# EAGLE design RPLidar_interface (EAGLE 7.4.0)

## Sheet 1 of 4
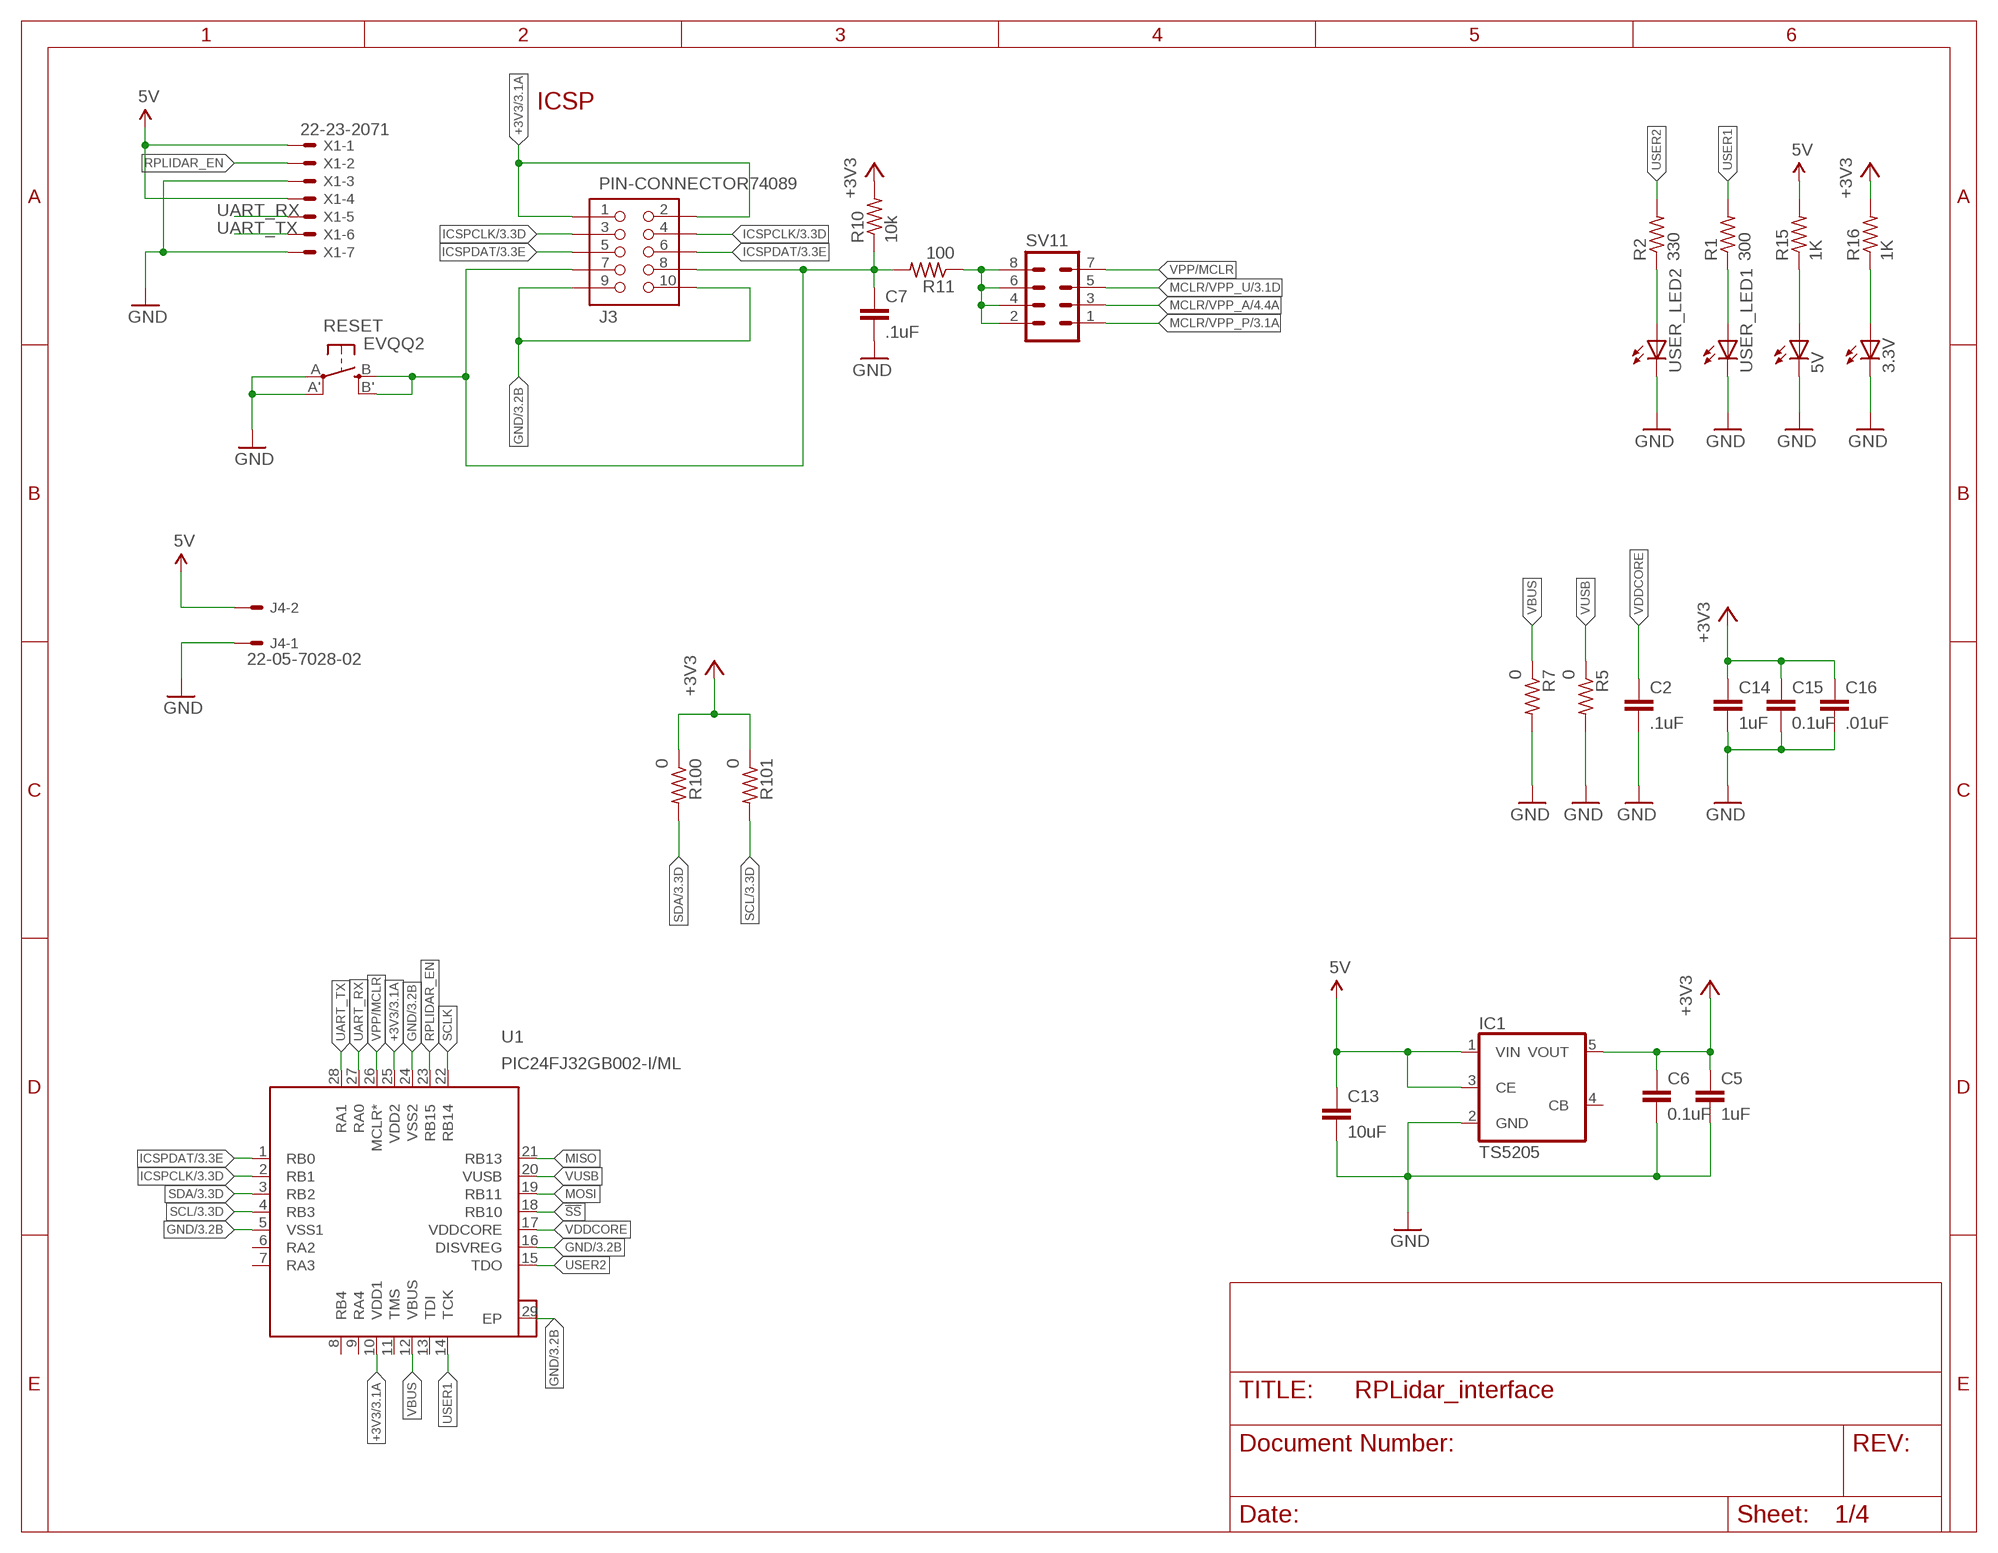
[diagram p0: schematic, sheet 1]

### Parts
3.3V  LEDCHIP-LED0603  [CHIP-LED0603]
5V  LEDCHIP-LED0603  [CHIP-LED0603]
C2  .1uF  C-EUC0402  [C0402]
C5  1uF  C-EUC0402  [C0402]
C6  0.1uF  C-EUC0402  [C0402]
C7  .1uF  C-EUC0402  [C0402]
C13  10uF  C-EUC0402  [C0402]
C14  1uF  C-EUC0402  [C0402]
C15  0.1uF  C-EUC0402  [C0402]
C16  .01uF  C-EUC0402  [C0402]
IC1  TS5205  [SOT25]
J3  PIN-CONNECTOR74089  [10-PIN-SMD]
J4  22-05-7028-02  [7395-02]
R1  300  R-US_R0402  [R0402]
R2  330  R-US_R0402  [R0402]
R5  0  R-US_R0402  [R0402]
R7  0  R-US_R0402  [R0402]
R10  10k  R-US_R0402  [R0402]
R11  100  R-US_R0402  [R0402]
R15  1K  R-US_R0402  [R0402]
R16  1K  R-US_R0402  [R0402]
R100  0  R-US_R0402  [R0402]
R101  0  R-US_R0402  [R0402]
RESET  EVQQ2  [EVQ-Q2]
SV11  MA04-2  [MA04-2]
U1  PIC24FJ32GB002-I/ML  [QFN65P600X600X100-29N]
USER_LED1  LEDCHIP-LED0603  [CHIP-LED0603]
USER_LED2  LEDCHIP-LED0603  [CHIP-LED0603]
X1  22-23-2071  [22-23-2071]

### Nets
5V: C13.1 IC1.1(VIN) IC1.3(CE) J4.2 R15.2 X1.1 X1.4 ; also sheet 4
!SS: U1.18(RB10) ; also sheet 2
+3V3: C5.1 C6.1 C14.1 C15.1 C16.1 IC1.5(VOUT) J3.1 J3.2 R10.2 R16.2 R100.1 R101.1 U1.10(VDD1) U1.25(VDD2) ; also sheet 3
GND: 3.3V.C 5V.C C2.2 C5.2 C6.2 C7.2 C13.2 C14.2 C15.2 C16.2 IC1.2(GND) J3.9 J3.10 J4.1 R5.2 R7.2 RESET.A'(P1) RESET.A(P) U1.5(VSS1) U1.16(DISVREG) U1.24(VSS2) U1.29(EP) USER_LED1.C USER_LED2.C X1.3 X1.7 ; also sheet 2,3,4
ICSPCLK: J3.3 J3.4 U1.2(RB1) ; also sheet 3,4
ICSPDAT: J3.5 J3.6 U1.1(RB0) ; also sheet 3,4
MCLR/VPP_A: SV11.3 ; also sheet 4
MCLR/VPP_P: SV11.1 ; also sheet 3
MCLR/VPP_U: SV11.5 ; also sheet 3
MCLR_LIDAR: C7.1 J3.7 J3.8 R10.1 R11.2 RESET.B'(S1) RESET.B(S)
MISO: U1.21(RB13) ; also sheet 2
MOSI: U1.19(RB11) ; also sheet 2
N$1: 3.3V.A R16.1
N$2: R1.1 USER_LED1.A
N$3: R2.1 USER_LED2.A
N$4: 5V.A R15.1
N$11: R11.1 SV11.2 SV11.4 SV11.6 SV11.8
RPLIDAR_EN: U1.23(RB15) X1.2
SCL: R101.2 U1.4(RB3) ; also sheet 2,3,4
SCLK: U1.22(RB14) ; also sheet 2
SDA: R100.2 U1.3(RB2) ; also sheet 2,3,4
UART_RX: U1.27(RA0) X1.5
UART_TX: U1.28(RA1) X1.6
USER1: R1.2 U1.14(TCK)
USER2: R2.2 U1.15(TDO)
VBUS: R7.1 U1.12(VBUS)
VDDCORE: C2.1 U1.17(VDDCORE)
VPP/MCLR: SV11.7 U1.26(MCLR*)
VUSB: R5.1 U1.20(VUSB)
Unconnected: IC1.4(CB) U1.6(RA2) U1.7(RA3) U1.8(RB4) U1.9(RA4) U1.11(TMS) U1.13(TDI)

### Notes on the sheet
- ICSP

## Sheet 2 of 4
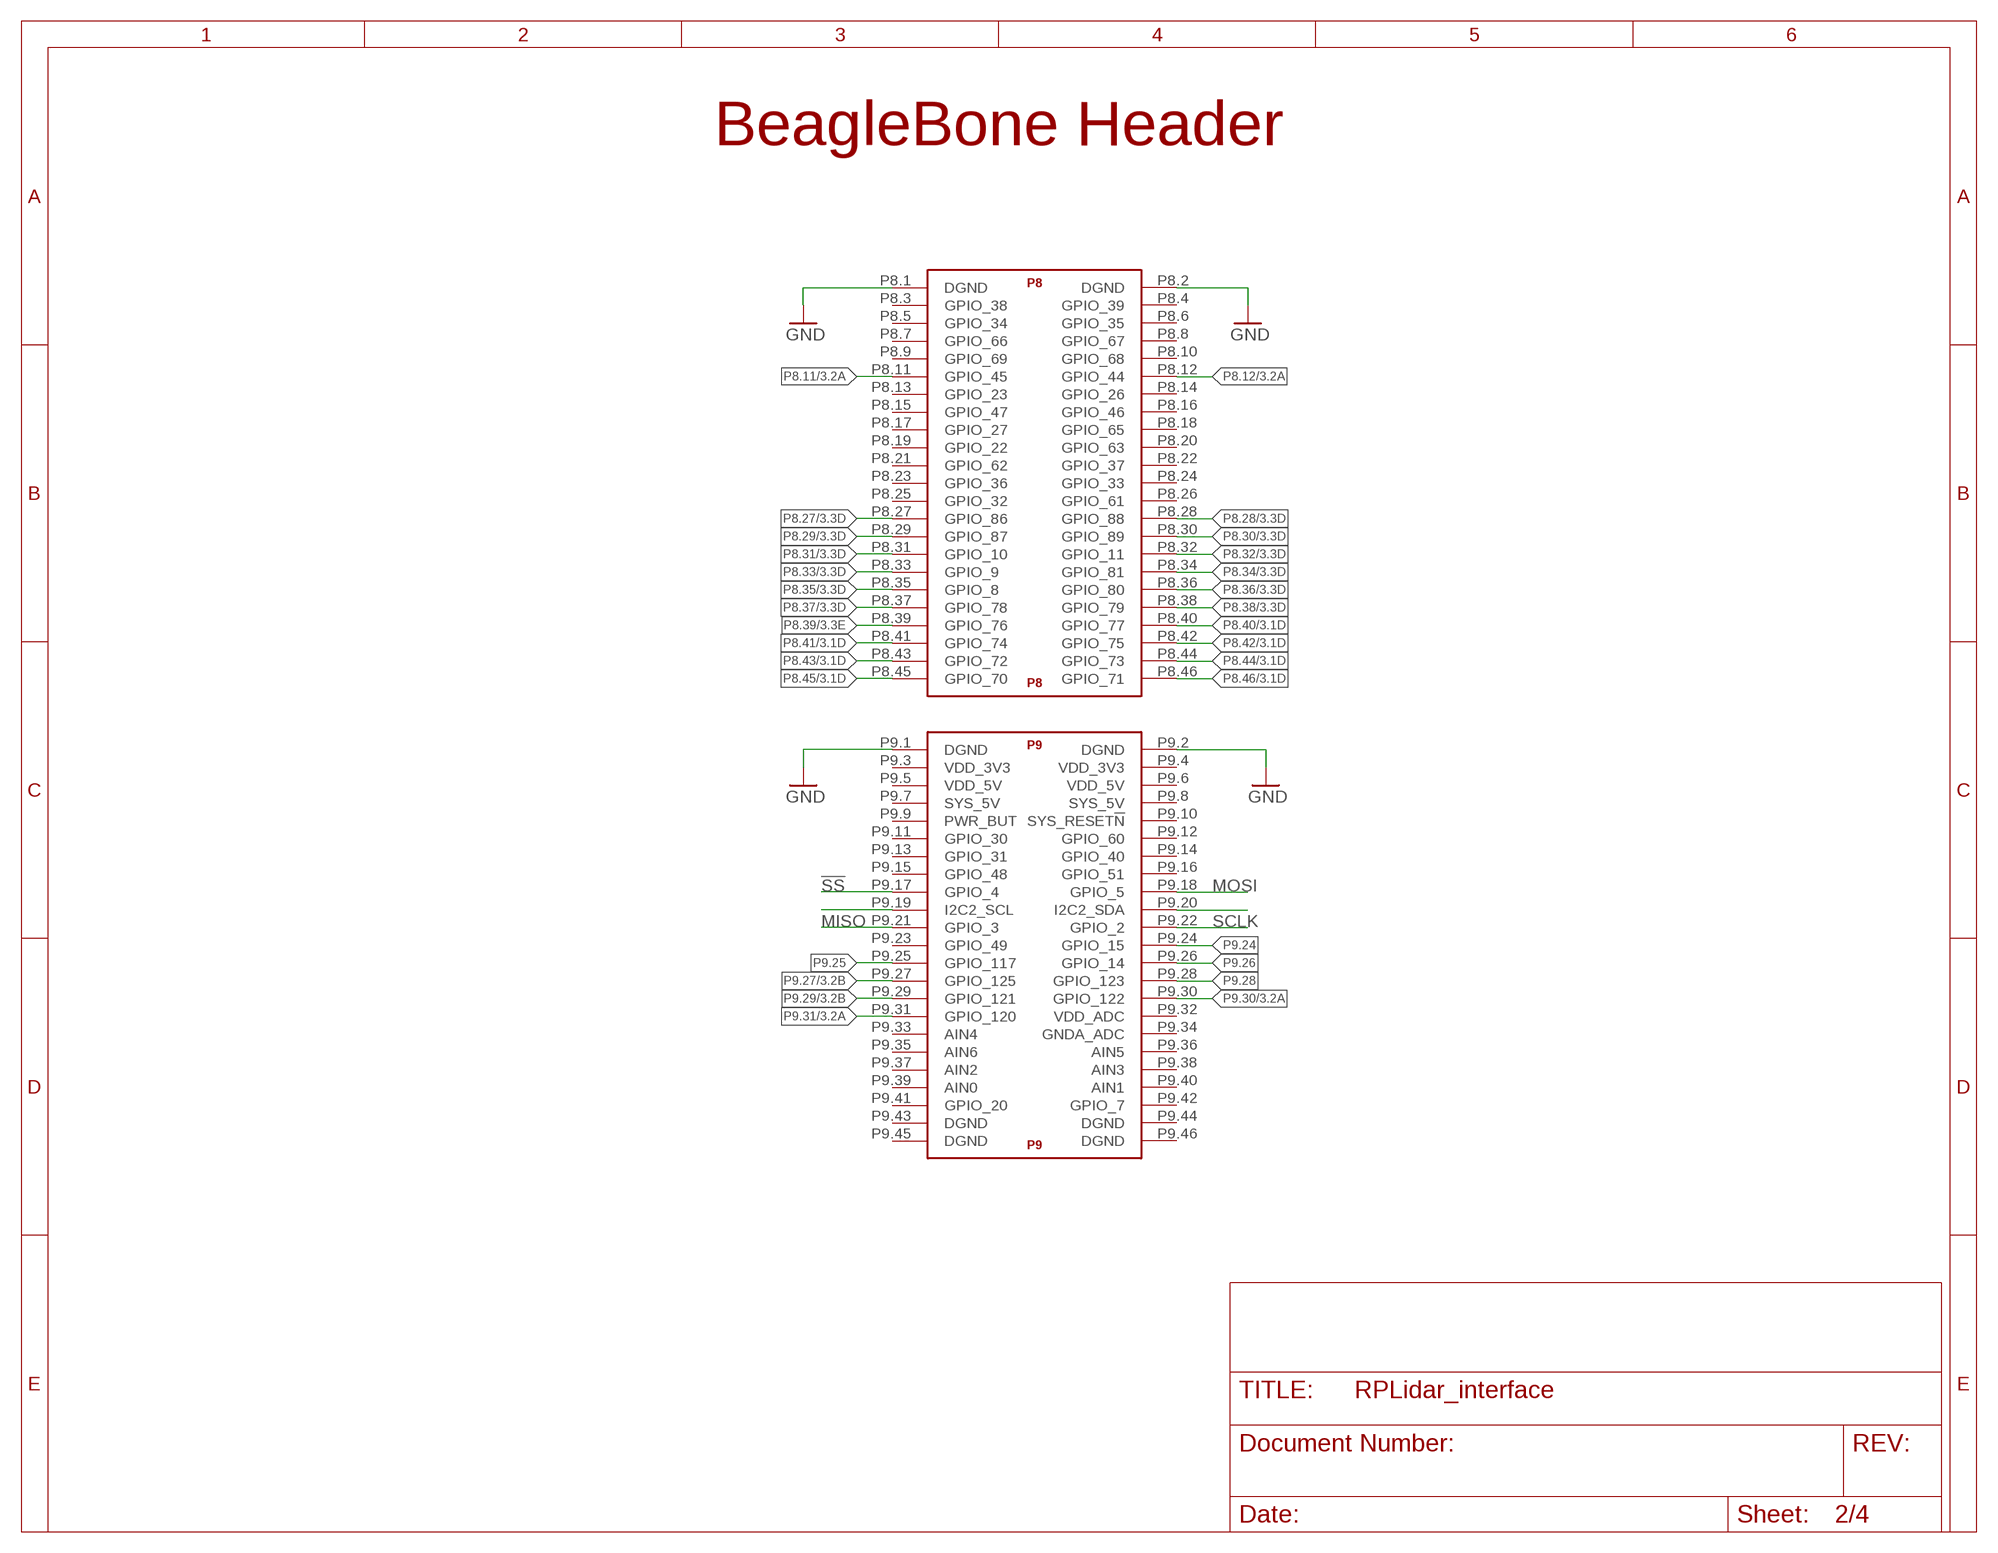
[diagram p1: schematic, sheet 2]

### Parts
U$3  BEAGLE_BONE_BLACK_CAPE  [BEAGLE_BONE_BLACK_CAPE]

### Nets
!SS: U$3.P9.17(P9:GPIO_4) ; also sheet 1
GND: U$3.P8.1(P8:DGND) U$3.P8.2(P8:DGND) U$3.P9.1(P9:DGND) U$3.P9.2(P9:DGND) ; also sheet 1,3,4
MISO: U$3.P9.21(P9:GPIO_3) ; also sheet 1
MOSI: U$3.P9.18(P9:GPIO_5) ; also sheet 1
P8.11: U$3.P8.11(P8:GPIO_45) ; also sheet 3
P8.12: U$3.P8.12(P8:GPIO_44) ; also sheet 3
P8.27: U$3.P8.27(P8:GPIO_86) ; also sheet 3
P8.28: U$3.P8.28(P8:GPIO_88) ; also sheet 3
P8.29: U$3.P8.29(P8:GPIO_87) ; also sheet 3
P8.30: U$3.P8.30(P8:GPIO_89) ; also sheet 3
P8.31: U$3.P8.31(P8:GPIO_10) ; also sheet 3
P8.32: U$3.P8.32(P8:GPIO_11) ; also sheet 3
P8.33: U$3.P8.33(P8:GPIO_9) ; also sheet 3
P8.34: U$3.P8.34(P8:GPIO_81) ; also sheet 3
P8.35: U$3.P8.35(P8:GPIO_8) ; also sheet 3
P8.36: U$3.P8.36(P8:GPIO_80) ; also sheet 3
P8.37: U$3.P8.37(P8:GPIO_78) ; also sheet 3
P8.38: U$3.P8.38(P8:GPIO_79) ; also sheet 3
P8.39: U$3.P8.39(P8:GPIO_76) ; also sheet 3
P8.40: U$3.P8.40(P8:GPIO_77) ; also sheet 3
P8.41: U$3.P8.41(P8:GPIO_74) ; also sheet 3
P8.42: U$3.P8.42(P8:GPIO_75) ; also sheet 3
P8.43: U$3.P8.43(P8:GPIO_72) ; also sheet 3
P8.44: U$3.P8.44(P8:GPIO_73) ; also sheet 3
P8.45: U$3.P8.45(P8:GPIO_70) ; also sheet 3
P8.46: U$3.P8.46(P8:GPIO_71) ; also sheet 3
P9.24: U$3.P9.24(P9:GPIO_15)
P9.25: U$3.P9.25(P9:GPIO_117) ; also sheet 3
P9.26: U$3.P9.26(P9:GPIO_14)
P9.27: U$3.P9.27(P9:GPIO_125) ; also sheet 3
P9.28: U$3.P9.28(P9:GPIO_123) ; also sheet 3
P9.29: U$3.P9.29(P9:GPIO_121) ; also sheet 3
P9.30: U$3.P9.30(P9:GPIO_122) ; also sheet 3
P9.31: U$3.P9.31(P9:GPIO_120) ; also sheet 3
SCL: U$3.P9.19(P9:I2C2_SCL) ; also sheet 1,3,4
SCLK: U$3.P9.22(P9:GPIO_2) ; also sheet 1
SDA: U$3.P9.20(P9:I2C2_SDA) ; also sheet 1,3,4
Unconnected: U$3.P8.3(P8:GPIO_38) U$3.P8.4(P8:GPIO_39) U$3.P8.5(P8:GPIO_34) U$3.P8.6(P8:GPIO_35) U$3.P8.7(P8:GPIO_66) U$3.P8.8(P8:GPIO_67) U$3.P8.9(P8:GPIO_69) U$3.P8.10(P8:GPIO_68) U$3.P8.13(P8:GPIO_23) U$3.P8.14(P8:GPIO_26) U$3.P8.15(P8:GPIO_47) U$3.P8.16(P8:GPIO_46) U$3.P8.17(P8:GPIO_27) U$3.P8.18(P8:GPIO_65) U$3.P8.19(P8:GPIO_22) U$3.P8.20(P8:GPIO_63) U$3.P8.21(P8:GPIO_62) U$3.P8.22(P8:GPIO_37) U$3.P8.23(P8:GPIO_36) U$3.P8.24(P8:GPIO_33) U$3.P8.25(P8:GPIO_32) U$3.P8.26(P8:GPIO_61) U$3.P9.3(P9:VDD_3V3) U$3.P9.4(P9:VDD_3V3) U$3.P9.5(P9:VDD_5V) U$3.P9.6(P9:VDD_5V) U$3.P9.7(P9:SYS_5V) U$3.P9.8(P9:SYS_5V) U$3.P9.9(P9:PWR_BUT) U$3.P9.10(P9:SYS_RESET!N) U$3.P9.11(P9:GPIO_30) U$3.P9.12(P9:GPIO_60) U$3.P9.13(P9:GPIO_31) U$3.P9.14(P9:GPIO_40) U$3.P9.15(P9:GPIO_48) U$3.P9.16(P9:GPIO_51) U$3.P9.23(P9:GPIO_49) U$3.P9.32(P9:VDD_ADC) U$3.P9.33(P9:AIN4) U$3.P9.34(P9:GNDA_ADC) U$3.P9.35(P9:AIN6) U$3.P9.36(P9:AIN5) U$3.P9.37(P9:AIN2) U$3.P9.38(P9:AIN3) U$3.P9.39(P9:AIN0) U$3.P9.40(P9:AIN1) U$3.P9.41(P9:GPIO_20) U$3.P9.42(P9:GPIO_7) U$3.P9.43(P9:DGND) U$3.P9.44(P9:DGND) U$3.P9.45(P9:DGND) U$3.P9.46(P9:DGND)

### Notes on the sheet
- BeagleBone Header

## Sheet 3 of 4
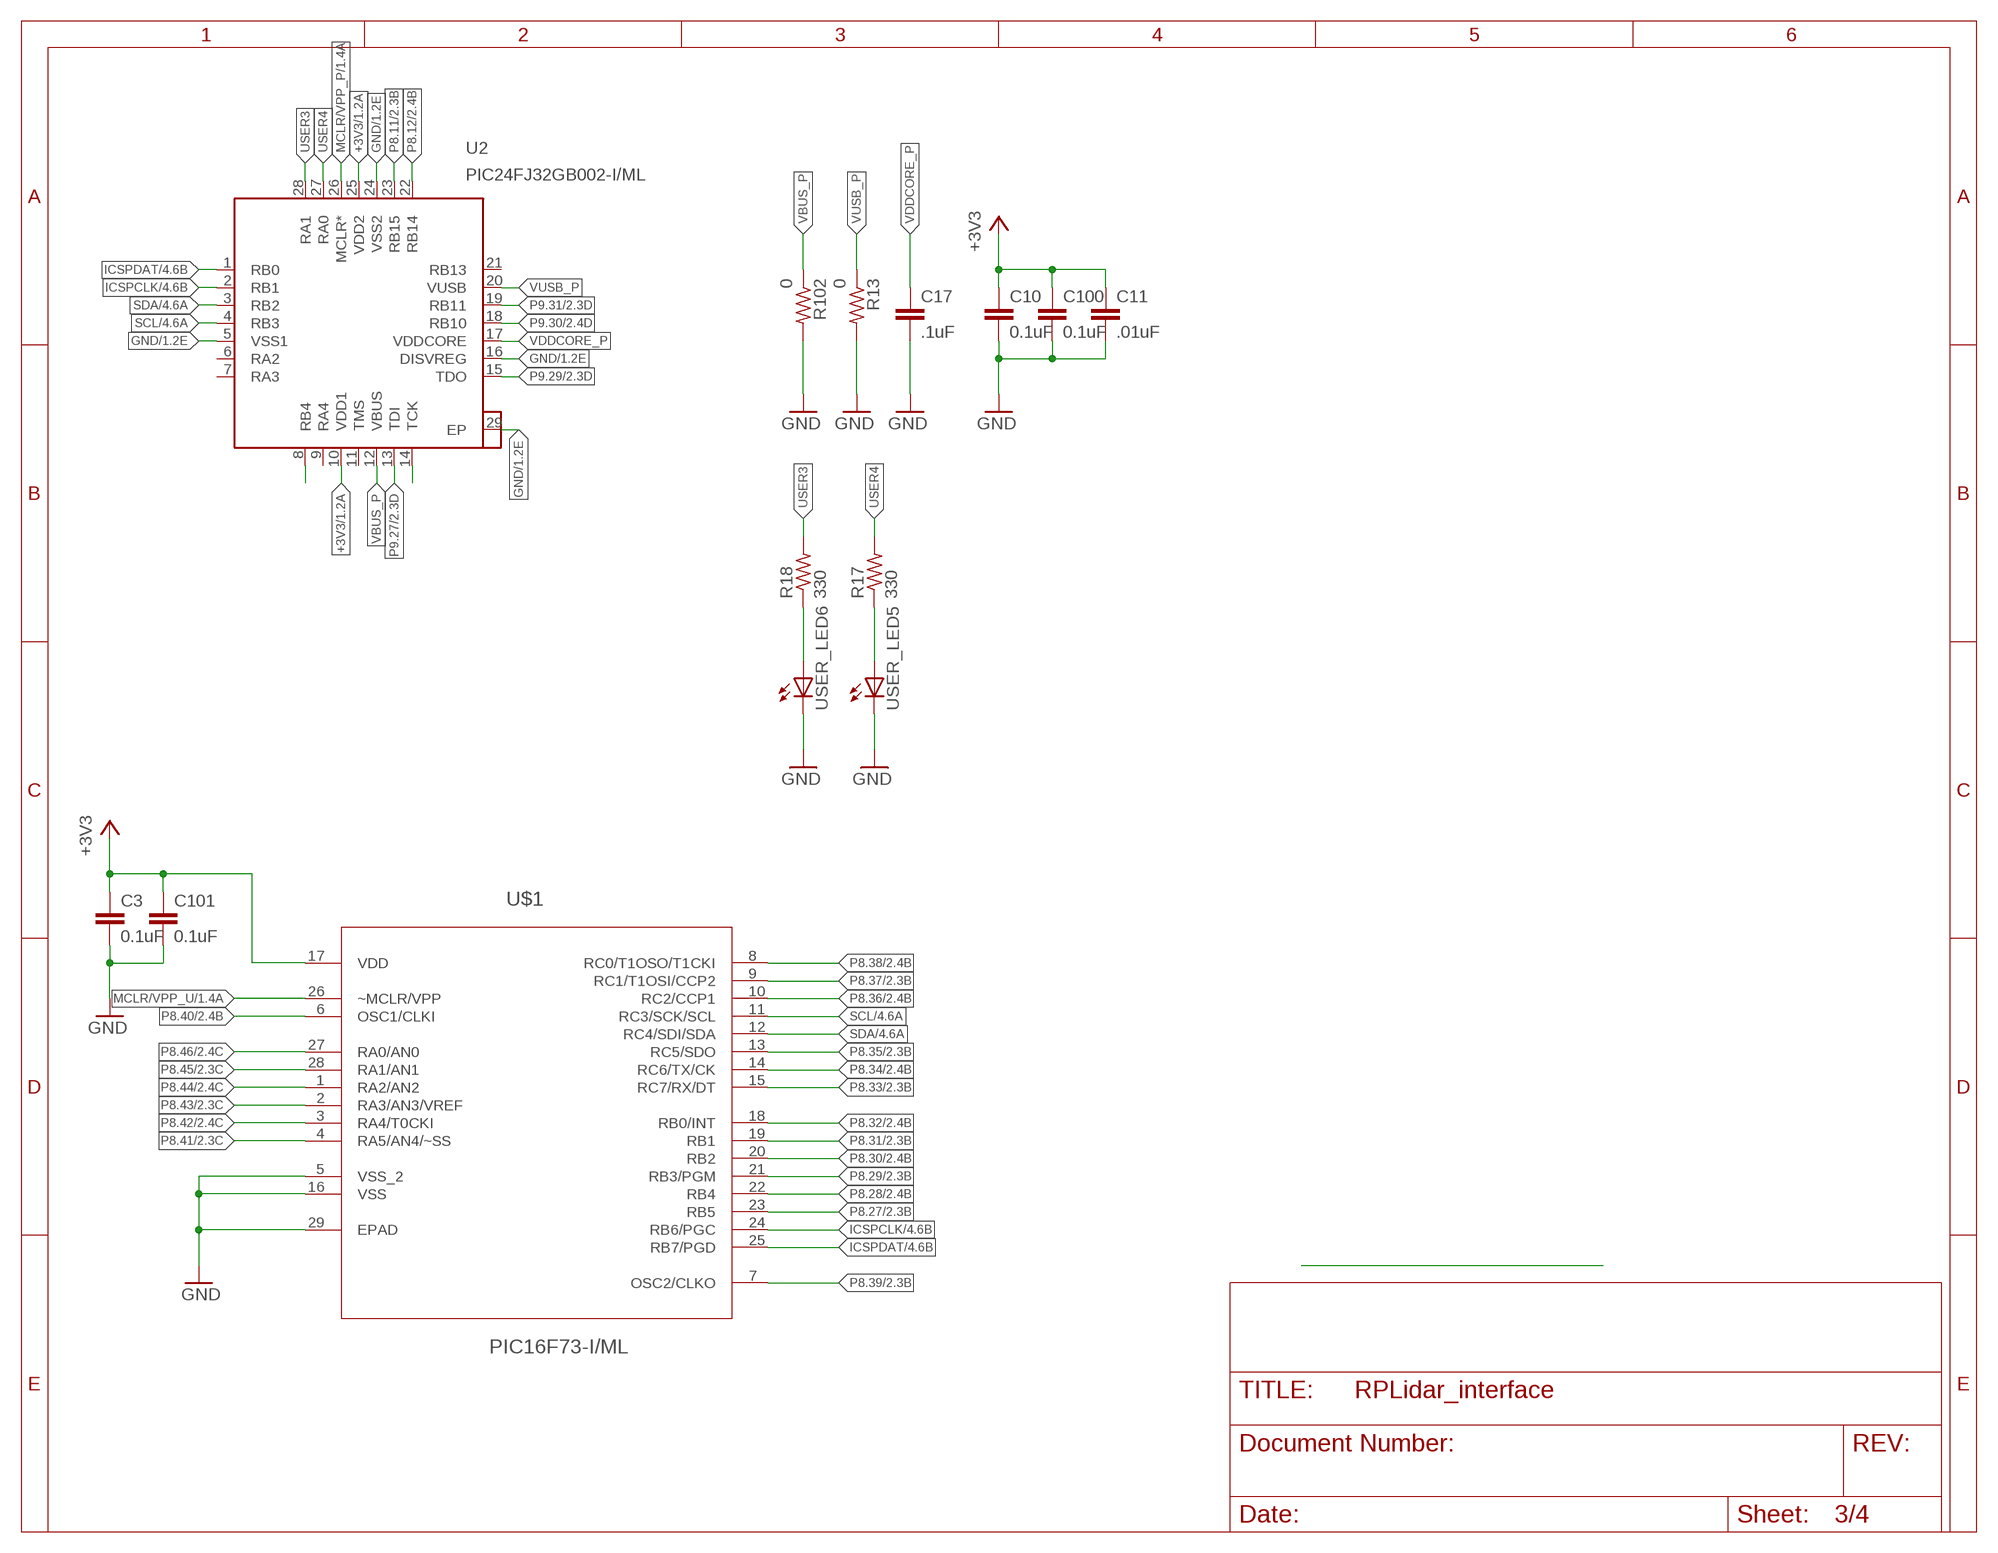
[diagram p2: schematic, sheet 3]

### Parts
C3  0.1uF  C-EUC0402  [C0402]
C10  0.1uF  C-EUC0402  [C0402]
C11  .01uF  C-EUC0402  [C0402]
C17  .1uF  C-EUC0402  [C0402]
C100  0.1uF  C-EUC0402  [C0402]
C101  0.1uF  C-EUC0402  [C0402]
R13  0  R-US_R0402  [R0402]
R17  330  R-US_R0402  [R0402]
R18  330  R-US_R0402  [R0402]
R102  0  R-US_R0402  [R0402]
U2  PIC24FJ32GB002-I/ML  [QFN65P600X600X100-29N]
U$1  PIC16F73-I/ML  [QFN65P600X600X100-28N]
USER_LED5  LEDCHIP-LED0603  [CHIP-LED0603]
USER_LED6  LEDCHIP-LED0603  [CHIP-LED0603]

### Nets
+3V3: C3.1 C10.1 C11.1 C100.1 C101.1 U2.10(VDD1) U2.25(VDD2) U$1.17(VDD) ; also sheet 1
GND: C3.2 C10.2 C11.2 C17.2 C100.2 C101.2 R13.2 R102.2 U2.5(VSS1) U2.16(DISVREG) U2.24(VSS2) U2.29(EP) U$1.5(VSS_2) U$1.16(VSS) U$1.29(EPAD) USER_LED5.C USER_LED6.C ; also sheet 1,2,4
ICSPCLK: U2.2(RB1) U$1.24(RB6/PGC) ; also sheet 1,4
ICSPDAT: U2.1(RB0) U$1.25(RB7/PGD) ; also sheet 1,4
MCLR/VPP_P: U2.26(MCLR*) ; also sheet 1
MCLR/VPP_U: U$1.26(~MCLR/VPP) ; also sheet 1
N$5: R17.1 USER_LED5.A
N$6: R18.1 USER_LED6.A
P8.11: U2.23(RB15) ; also sheet 2
P8.12: U2.22(RB14) ; also sheet 2
P8.27: U$1.23(RB5) ; also sheet 2
P8.28: U$1.22(RB4) ; also sheet 2
P8.29: U$1.21(RB3/PGM) ; also sheet 2
P8.30: U$1.20(RB2) ; also sheet 2
P8.31: U$1.19(RB1) ; also sheet 2
P8.32: U$1.18(RB0/INT) ; also sheet 2
P8.33: U$1.15(RC7/RX/DT) ; also sheet 2
P8.34: U$1.14(RC6/TX/CK) ; also sheet 2
P8.35: U$1.13(RC5/SDO) ; also sheet 2
P8.36: U$1.10(RC2/CCP1) ; also sheet 2
P8.37: U$1.9(RC1/T1OSI/CCP2) ; also sheet 2
P8.38: U$1.8(RC0/T1OSO/T1CKI) ; also sheet 2
P8.39: U$1.7(OSC2/CLKO) ; also sheet 2
P8.40: U$1.6(OSC1/CLKI) ; also sheet 2
P8.41: U$1.4(RA5/AN4/~SS) ; also sheet 2
P8.42: U$1.3(RA4/T0CKI) ; also sheet 2
P8.43: U$1.2(RA3/AN3/VREF) ; also sheet 2
P8.44: U$1.1(RA2/AN2) ; also sheet 2
P8.45: U$1.28(RA1/AN1) ; also sheet 2
P8.46: U$1.27(RA0/AN0) ; also sheet 2
P9.25: U2.8(RB4) ; also sheet 2
P9.27: U2.13(TDI) ; also sheet 2
P9.28: U2.14(TCK) ; also sheet 2
P9.29: U2.15(TDO) ; also sheet 2
P9.30: U2.18(RB10) ; also sheet 2
P9.31: U2.19(RB11) ; also sheet 2
SCL: U2.4(RB3) U$1.11(RC3/SCK/SCL) ; also sheet 1,2,4
SDA: U2.3(RB2) U$1.12(RC4/SDI/SDA) ; also sheet 1,2,4
USER3: R18.2 U2.28(RA1)
USER4: R17.2 U2.27(RA0)
VBUS_P: R102.1 U2.12(VBUS)
VDDCORE_P: C17.1 U2.17(VDDCORE)
VUSB_P: R13.1 U2.20(VUSB)
Unconnected: U2.6(RA2) U2.7(RA3) U2.9(RA4) U2.11(TMS) U2.21(RB13)

## Sheet 4 of 4
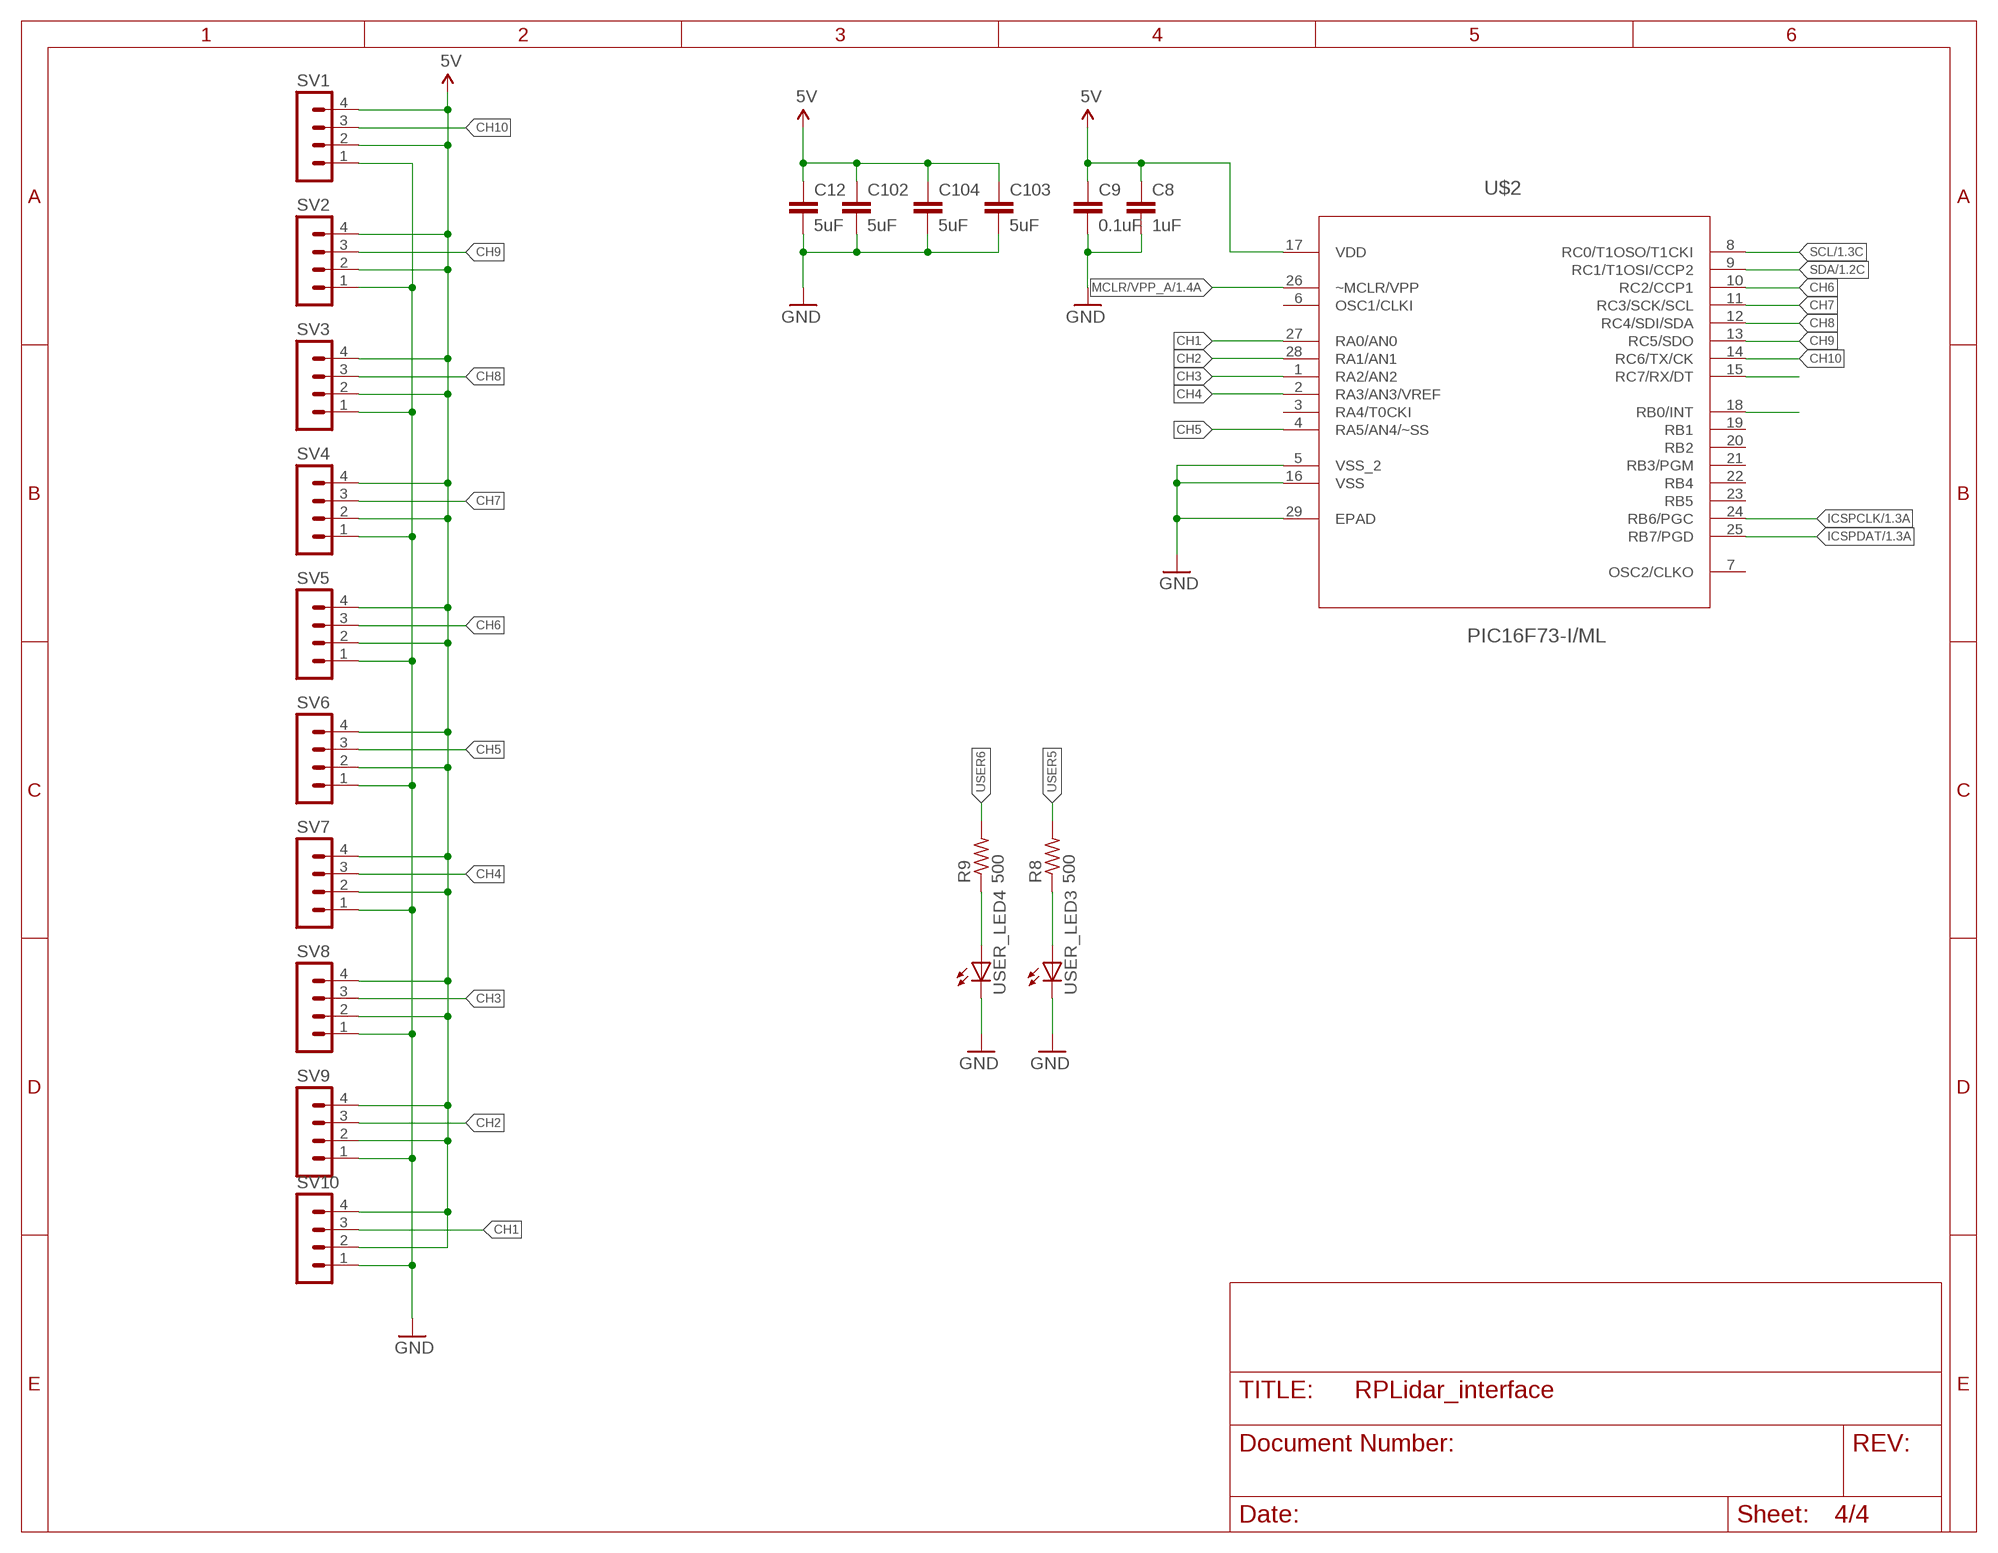
[diagram p3: schematic, sheet 4]

### Parts
C8  1uF  C-EUC0402  [C0402]
C9  0.1uF  C-EUC0402  [C0402]
C12  5uF  C-EUC0402  [C0402]
C102  5uF  C-EUC0402  [C0402]
C103  5uF  C-EUC0402  [C0402]
C104  5uF  C-EUC0402  [C0402]
R8  500  R-US_R0402  [R0402]
R9  500  R-US_R0402  [R0402]
SV1  MA04-1  [MA04-1]
SV2  MA04-1  [MA04-1]
SV3  MA04-1  [MA04-1]
SV4  MA04-1  [MA04-1]
SV5  MA04-1  [MA04-1]
SV6  MA04-1  [MA04-1]
SV7  MA04-1  [MA04-1]
SV8  MA04-1  [MA04-1]
SV9  MA04-1  [MA04-1]
SV10  MA04-1  [MA04-1]
U$2  PIC16F73-I/ML  [QFN65P600X600X100-28N]
USER_LED3  LEDCHIP-LED0603  [CHIP-LED0603]
USER_LED4  LEDCHIP-LED0603  [CHIP-LED0603]

### Nets
5V: C8.1 C9.1 C12.1 C102.1 C103.1 C104.1 SV1.2 SV1.4 SV2.2 SV2.4 SV3.2 SV3.4 SV4.2 SV4.4 SV5.2 SV5.4 SV6.2 SV6.4 SV7.2 SV7.4 SV8.2 SV8.4 SV9.2 SV9.4 SV10.2 SV10.4 U$2.17(VDD) ; also sheet 1
CH1: SV10.3 U$2.27(RA0/AN0)
CH2: SV9.3 U$2.28(RA1/AN1)
CH3: SV8.3 U$2.1(RA2/AN2)
CH4: SV7.3 U$2.2(RA3/AN3/VREF)
CH5: SV6.3 U$2.4(RA5/AN4/~SS)
CH6: SV5.3 U$2.10(RC2/CCP1)
CH7: SV4.3 U$2.11(RC3/SCK/SCL)
CH8: SV3.3 U$2.12(RC4/SDI/SDA)
CH9: SV2.3 U$2.13(RC5/SDO)
CH10: SV1.3 U$2.14(RC6/TX/CK)
GND: C8.2 C9.2 C12.2 C102.2 C103.2 C104.2 SV1.1 SV2.1 SV3.1 SV4.1 SV5.1 SV6.1 SV7.1 SV8.1 SV9.1 SV10.1 U$2.5(VSS_2) U$2.16(VSS) U$2.29(EPAD) USER_LED3.C USER_LED4.C ; also sheet 1,2,3
ICSPCLK: U$2.24(RB6/PGC) ; also sheet 1,3
ICSPDAT: U$2.25(RB7/PGD) ; also sheet 1,3
MCLR/VPP_A: U$2.26(~MCLR/VPP) ; also sheet 1
N$9: R8.1 USER_LED3.A
N$10: R9.1 USER_LED4.A
SCL: U$2.8(RC0/T1OSO/T1CKI) ; also sheet 1,2,3
SDA: U$2.9(RC1/T1OSI/CCP2) ; also sheet 1,2,3
USER5: R8.2 U$2.15(RC7/RX/DT)
USER6: R9.2 U$2.18(RB0/INT)
Unconnected: U$2.3(RA4/T0CKI) U$2.6(OSC1/CLKI) U$2.7(OSC2/CLKO) U$2.19(RB1) U$2.20(RB2) U$2.21(RB3/PGM) U$2.22(RB4) U$2.23(RB5)

## Library data of the parts
3.3V 5V USER_LED1-USER_LED6 = led:LED: LED OSRAM: - CHIPLED LG R971, LG N971, LY N971, LG Q971, LY Q971, LO R971, LY R971 LH N974, LH R974 LS Q976, LO Q976, LY Q976 LO Q996 - Hyper CHIPLED LW Q18S LB Q993, LB Q99A, LB R99A - SideLED LS A670, LO A670, LY A670, LG A670, LP A670 LB A673, LV A673, LT A673, LW A673 LH A674 LY A675 LS A676, LA A676, LO A676, LY A676, LW A676 LS A679, LY A679, LG A679 - Hyper Micro SIDELED® LS Y876, LA Y876, LO Y876, LY Y876 LT Y87S - SmartLED LW L88C, LW L88S LB L89C, LB L89S, LG L890 LS L89K, LO L89K, LY L89K LS L896, LA L896, LO L896, LY L896 - TOPLED LS T670, LO T670, LY T670, LG T670, LP T670 LSG T670, LSP T670, LSY T670, LOP T670, LYG T670 LG T671, LOG T671, LSG T671 LB T673, LV T673, LT T673, LW T673 LH T674 LS T676, LA T676, LO T676, LY T676, LB T676, LH T676, LSB T676, LW T676 LB T67C, LV T67C, LT T67C, LS T67K, LO T67K, LY T67K, LW E67C LS E67B, LA E67B, LO E67B, LY E67B, LB E67C, LV E67C, LT E67C LW T67C LS T679, LY T679, LG T679 LS T770, LO T770, LY T770, LG T770, LP T770 LB T773, LV T773, LT T773, LW T773 LH T774 LS E675, LA E675, LY E675, LS T675 LS T776, LA T776, LO T776, LY T776, LB T776 LHGB T686 LT T68C, LB T68C - Hyper Mini TOPLED® LB M676 - Mini TOPLED Santana® LG M470 LS M47K, LO M47K, LY M47K Source: http://www.osram.convergy.de LUXEON: - LUMILED® LXK2-PW12-R00, LXK2-PW12-S00, LXK2-PW14-U00, LXK2-PW14-V00 LXK2-PM12-R00, LXK2-PM12-S00, LXK2-PM14-U00 LXK2-PE12-Q00, LXK2-PE12-R00, LXK2-PE12-S00, LXK2-PE14-T00, LXK2-PE14-U00 LXK2-PB12-K00, LXK2-PB12-L00, LXK2-PB12-M00, LXK2-PB14-N00, LXK2-PB14-P00, LXK2-PB14-Q00 LXK2-PR12-L00, LXK2-PR12-M00, LXK2-PR14-Q00, LXK2-PR14-R00 LXK2-PD12-Q00, LXK2-PD12-R00, LXK2-PD12-S00 LXK2-PH12-R00, LXK2-PH12-S00 LXK2-PL12-P00, LXK2-PL12-Q00, LXK2-PL12-R00 Source: www.luxeon.com KINGBRIGHT: KA-3528ASYC Source: www.kingbright.com
C2 C3 C5-C17 C100-C104 = rcl:C-EU: CAPACITOR, European symbol
IC1 = v-reg:TS5205: 150mA Low Noise LDO Voltage Regulator with Enable TSC [Taiwan Semiconductor Company, Ltd] Source: http://www.taiwansemi.com .. 5205_0409c.pdf
J3 = Mother-Board-rev5:PIN-CONNECTOR
J4 = con-molex:22-?-02: CONNECTOR wire to board 2.54 mm (.1 inch) pitch header; OC_FARNELL: 9731601; OC_NEWARK: unknown
R1 R2 R5 R7-R11 R13 R15-R18 R100-R102 = resistor:R-US_: RESISTOR, American symbol
RESET = adafruit:EVQQ2: SMT 6mm switch, EVQQ2 series http://www.ladyada.net/library/eagle
SV1-SV10 = con-lstb:MA04-1: PIN HEADER; OC_FARNELL: unknown; OC_NEWARK: unknown
SV11 = con-lstb:MA04-2: PIN HEADER; OC_FARNELL: unknown; OC_NEWARK: unknown
U1 U2 = Microchip-PIC24:PIC24FJ32GB002-I/ML: IC MCU 16BIT 32KB FLASH,QFN-28; MPN: PIC24FJ32GB002-I/ML; OC_FARNELL: Unknown; OC_NEWARK: 07P9727; PACKAGE: QFN-28; SUPPLIER: Microchip
U$1 U$2 = Microchip_By_element14_Batch_1:PIC16F73-I/ML: 8-bit CMOS FLASH Microcontrollers; DESCRIPTION: 8-bit CMOS FLASH Microcontrollers; MPN: PIC16F73-I/ML; OC_FARNELL: 1084327; OC_NEWARK: 97K7368; PACKAGE: QFN-28; SUPPLIER: Microchip
U$3 = SparkFun-Boards:BEAGLE_BONE_BLACK_CAPE
X1 = con-molex:22-23-2071: .100" (2.54mm) Center Header - 7 Pin; MF: MOLEX; MPN: 22-23-2071; OC_FARNELL: 1654534; OC_NEWARK: 56H0445

## Board
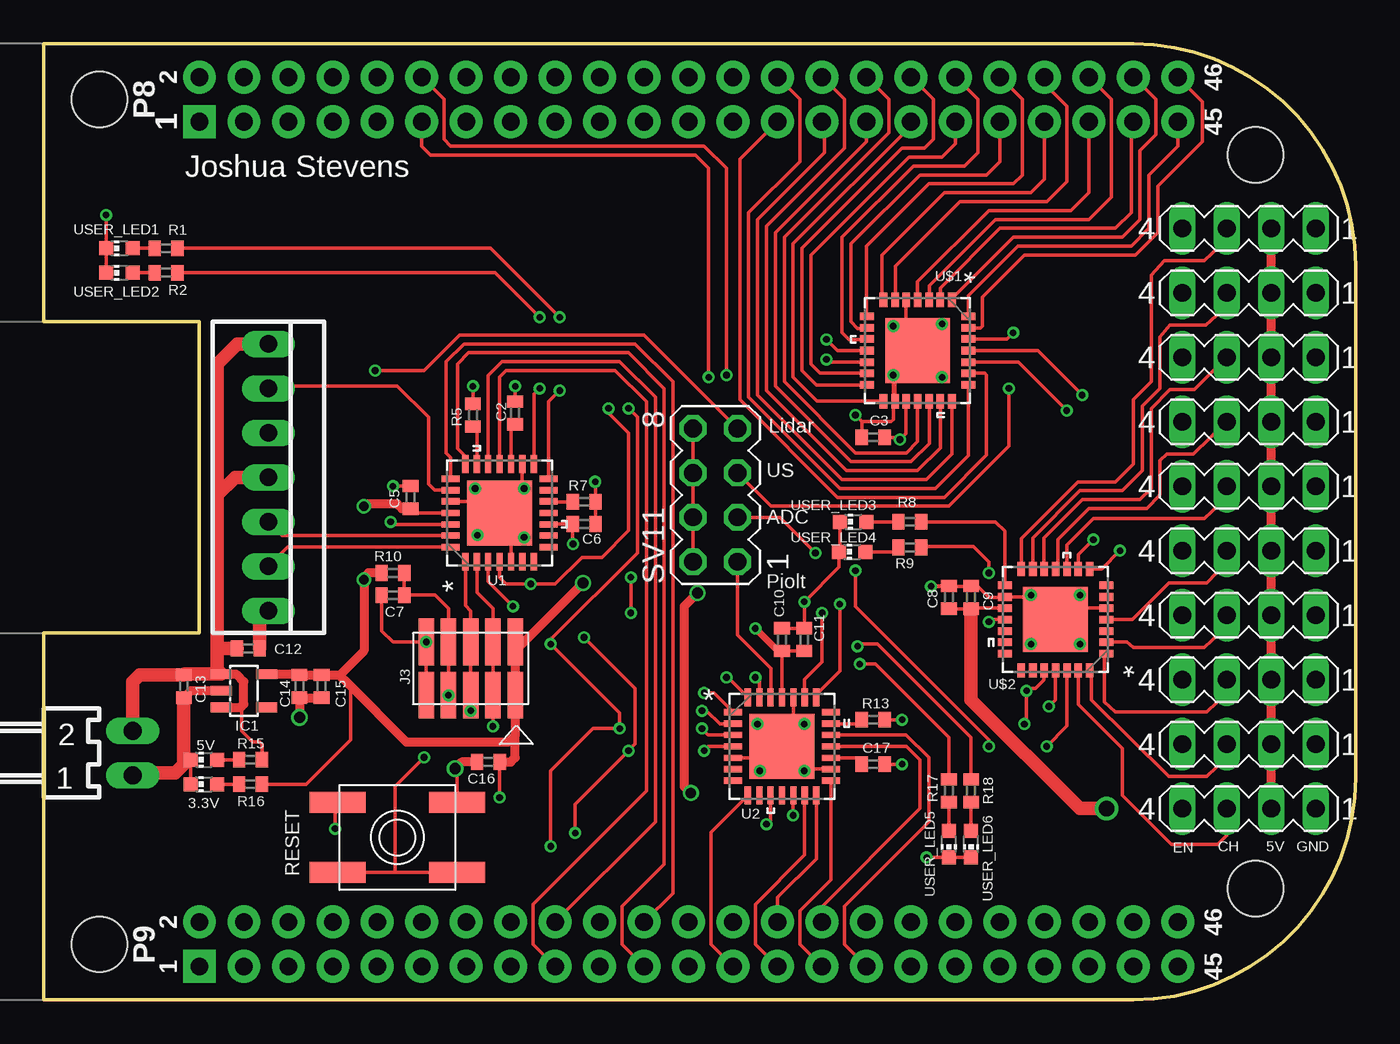
[diagram p4: board, top side]
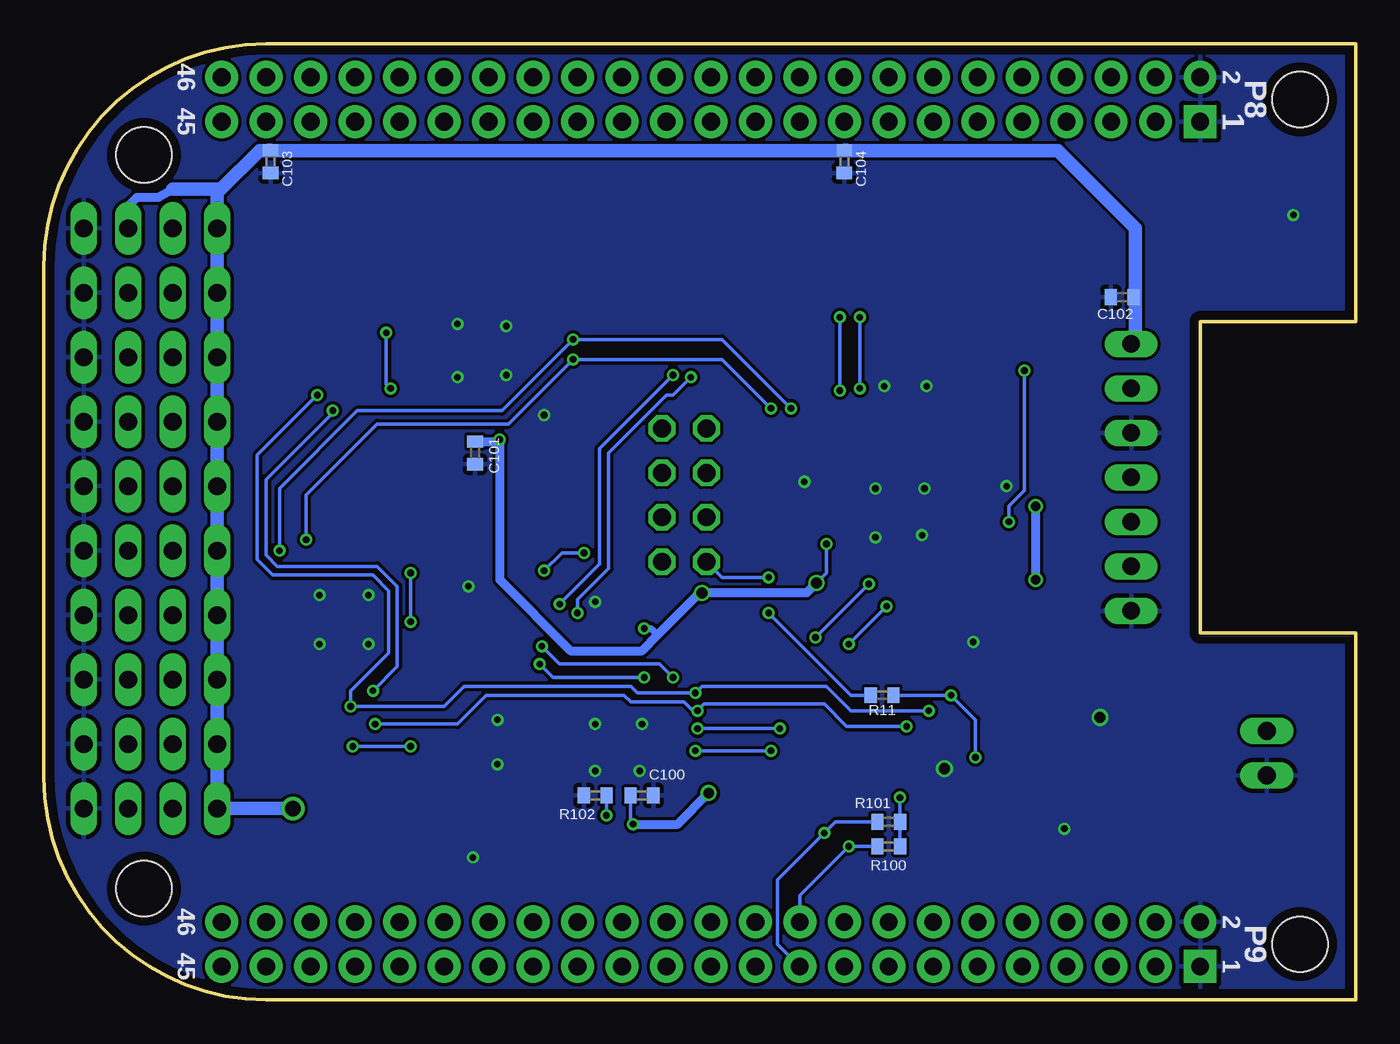
[diagram p5: board, bottom side, seen from below]

Size 74.93 x 54.61 mm. Coordinates in mm from the lower left corner, seen from the top.
Outline: 0,20.95 0,0 62.23,0 arc90 74.93,12.7 74.93,41.91 arc90 62.23,54.61 0,54.61 0,38.73 8.89,38.73 8.89,20.95 0,20.95
Copper layers (1*16): Top 0.035mm / dielectric 1.5mm / Bottom 0.035mm
Design rules "EagleRules-2-Layer": minimum track width 7mil, minimum drill 12mil, track to track 7mil, track to pad 7mil, pad to pad 7mil, via to via 7mil, smd to smd 0mil, copper to edge 20mil, drill to drill 10mil, minimum pad ring 10mil, minimum via ring 6mil, stop-mask expansion 2mil, vias tented up to drill 25mil, thermal gap 10mil

### Footprints (pad centres in the part's own frame; a part is rotated, then mirrored left to right if it is on the bottom)
CHIP-LED0603 = smd 0.8 x 0.8: A 0,-0.75; C 0,0.75
C0402 = smd 0.7 x 0.9: 1 -0.65,0; 2 0.65,0
SOT25 = smd 0.55 x 1.2: 1 -0.95,-1.3; 2 0,-1.3; 3 0.95,-1.3; 4 0.95,1.3; 5 -0.95,1.3
10-PIN-SMD = smd 0.889 x 2.667: 1 -2.54,1.524; 2 -2.54,-1.524; 3 -1.27,1.524; 4 -1.27,-1.524; 5 0,1.524; 6 0,-1.524; 7 1.27,1.524; 8 1.27,-1.524; 9 2.54,1.524; 10 2.54,-1.524
7395-02 = drill 1.016 long: 1 1.27,0; 2 -1.27,0
R0402 = smd 0.7 x 0.9: 1 -0.65,0; 2 0.65,0
EVQ-Q2 = smd 3.2 x 1.2: A -3.4,-2; A' 3.4,-2; B -3.4,2; B' 3.4,2
MA04-1 = drill 1.016 long: 1 -3.81,0; 2 -1.27,0; 3 1.27,0; 4 3.81,0
MA04-2 = drill 1.016 octagon: 1 -3.81,-1.27; 2 -3.81,1.27; 3 -1.27,-1.27; 4 -1.27,1.27; 5 1.27,-1.27; 6 1.27,1.27; 7 3.81,-1.27; 8 3.81,1.27
QFN65P600X600X100-29N = smd 1.016 x 0.356: 1 -2.794,1.956; 2 -2.794,1.295; 3 -2.794,0.66; 4 -2.794,0; 5 -2.794,-0.66; 6 -2.794,-1.295; 7 -2.794,-1.956; 15 2.794,-1.956; 16 2.794,-1.295; 17 2.794,-0.66; 18 2.794,0; 19 2.794,0.66; 20 2.794,1.295; 21 2.794,1.956 | smd 0.356 x 1.016: 8 -1.956,-2.794; 9 -1.295,-2.794; 10 -0.66,-2.794; 11 0,-2.794; 12 0.66,-2.794; 13 1.295,-2.794; 14 1.956,-2.794; 22 1.956,2.794; 23 1.295,2.794; 24 0.66,2.794; 25 0,2.794; 26 -0.66,2.794; 27 -1.295,2.794; 28 -1.956,2.794 | smd 3.708 x 3.708: 29 0,0
QFN65P600X600X100-28N = smd 0.813 x 0.432: 1 -2.896,1.956; 2 -2.896,1.295; 3 -2.896,0.66; 4 -2.896,0; 5 -2.896,-0.66; 6 -2.896,-1.295; 7 -2.896,-1.956; 15 2.896,-1.956; 16 2.896,-1.295; 17 2.896,-0.66; 18 2.896,0; 19 2.896,0.66; 20 2.896,1.295; 21 2.896,1.956 | smd 0.432 x 0.813: 8 -1.956,-2.896; 9 -1.295,-2.896; 10 -0.66,-2.896; 11 0,-2.896; 12 0.66,-2.896; 13 1.295,-2.896; 14 1.956,-2.896; 22 1.956,2.896; 23 1.295,2.896; 24 0.66,2.896; 25 0,2.896; 26 -0.66,2.896; 27 -1.295,2.896; 28 -1.956,2.896 | smd 3.708 x 3.708: 29 0,0
BEAGLE_BONE_BLACK_CAPE = drill 1.016 pad 1.88 square: P8.1 20.32,50.165; P9.1 20.32,1.905 | drill 1.016 pad 1.88: P8.2 20.32,52.705; P8.3 22.86,50.165; P8.4 22.86,52.705; P8.5 25.4,50.165; P8.6 25.4,52.705; P8.7 27.94,50.165; P8.8 27.94,52.705; P8.9 30.48,50.165; P8.10 30.48,52.705; P8.11 33.02,50.165; P8.12 33.02,52.705; P8.13 35.56,50.165; P8.14 35.56,52.705; P8.15 38.1,50.165; P8.16 38.1,52.705; P8.17 40.64,50.165; P8.18 40.64,52.705; P8.19 43.18,50.165; P8.20 43.18,52.705; P8.21 45.72,50.165; P8.22 45.72,52.705; P8.23 48.26,50.165; P8.24 48.26,52.705; P8.25 50.8,50.165; P8.26 50.8,52.705; P8.27 53.34,50.165; P8.28 53.34,52.705; P8.29 55.88,50.165; P8.30 55.88,52.705; P8.31 58.42,50.165; P8.32 58.42,52.705; P8.33 60.96,50.165; P8.34 60.96,52.705; P8.35 63.5,50.165; P8.36 63.5,52.705; P8.37 66.04,50.165; P8.38 66.04,52.705; P8.39 68.58,50.165; P8.40 68.58,52.705; P8.41 71.12,50.165; P8.42 71.12,52.705; P8.43 73.66,50.165; P8.44 73.66,52.705; P8.45 76.2,50.165; P8.46 76.2,52.705; P9.2 20.32,4.445; P9.3 22.86,1.905; P9.4 22.86,4.445; P9.5 25.4,1.905; P9.6 25.4,4.445; P9.7 27.94,1.905; P9.8 27.94,4.445; P9.9 30.48,1.905; P9.10 30.48,4.445; P9.11 33.02,1.905; P9.12 33.02,4.445; P9.13 35.56,1.905; P9.14 35.56,4.445; P9.15 38.1,1.905; P9.16 38.1,4.445; P9.17 40.64,1.905; P9.18 40.64,4.445; P9.19 43.18,1.905; P9.20 43.18,4.445; P9.21 45.72,1.905; P9.22 45.72,4.445; P9.23 48.26,1.905; P9.24 48.26,4.445; P9.25 50.8,1.905; P9.26 50.8,4.445; P9.27 53.34,1.905; P9.28 53.34,4.445; P9.29 55.88,1.905; P9.30 55.88,4.445; P9.31 58.42,1.905; P9.32 58.42,4.445; P9.33 60.96,1.905; P9.34 60.96,4.445; P9.35 63.5,1.905; P9.36 63.5,4.445; P9.37 66.04,1.905; P9.38 66.04,4.445; P9.39 68.58,1.905; P9.40 68.58,4.445; P9.41 71.12,1.905; P9.42 71.12,4.445; P9.43 73.66,1.905; P9.44 73.66,4.445; P9.45 76.2,1.905; P9.46 76.2,4.445 | hole 3.175: 14.605,3.175; 80.645,6.35; 80.645,48.26; 14.605,51.435
22-23-2071 = drill 1 long: 1 -7.62,0; 2 -5.08,0; 3 -2.54,0; 4 0,0; 5 2.54,0; 6 5.08,0; 7 7.62,0

### Placement (x,y rotation side)
3.3V  9.14,12.32 90 top
5V  9.14,13.72 90 top
C2  26.92,33.53 90 top
C3  47.37,32.13 180 top
C5  20.95,28.7 90 top
C6  30.86,27.18 0 top
C7  19.94,23.11 180 top
C8  51.69,22.99 90 top
C9  52.96,22.99 90 top
C10  42.16,20.57 90 top
C11  43.43,20.57 90 top
C12  11.68,20.07 0 top
C13  8,17.91 270 top
C14  14.61,17.91 270 top
C15  15.88,17.91 270 top
C16  25.4,13.59 180 top
C17  47.37,13.46 0 top
C100  40.77,11.68 0 bottom
C101  50.29,31.24 270 bottom
C102  13.34,40.13 180 bottom
C103  61.98,47.88 270 bottom
C104  29.21,47.88 270 bottom
IC1  11.43,17.65 270 top
J3  24.38,18.92 180 top
J4  5.08,14.1 270 top
R1  6.98,42.93 0 top
R2  6.98,41.53 0 top
R5  24.51,33.4 90 top
R7  30.86,28.45 0 top
R8  49.47,27.3 0 top
R9  49.47,25.84 0 top
R10  19.94,24.38 180 top
R11  27.05,17.4 0 bottom
R13  47.37,16 0 top
R15  11.81,13.72 0 top
R16  11.81,12.32 0 top
R17  51.69,11.94 90 top
R18  52.96,11.94 90 top
R100  26.67,8.76 180 bottom
R101  26.67,10.16 180 bottom
R102  43.43,11.68 180 bottom
RESET  20.19,9.27 180 top
SV1  68.83,44.07 180 top
SV2  68.83,40.39 180 top
SV3  68.83,36.7 180 top
SV4  68.83,33.02 180 top
SV5  68.83,29.34 180 top
SV6  68.83,25.65 180 top
SV7  68.83,21.97 180 top
SV8  68.83,18.29 180 top
SV9  68.83,14.61 180 top
SV10  68.83,10.92 180 top
SV11  38.35,28.83 90 top
U1  26.04,27.81 90 top
U2  42.16,14.48 0 top
U$1  49.91,37.08 270 top
U$2  57.79,21.72 180 top
U$3  -11.43,0 0 top
USER_LED1  4.32,42.93 90 top
USER_LED2  4.32,41.53 90 top
USER_LED3  46.23,27.3 90 top
USER_LED4  46.16,25.59 90 top
USER_LED5  51.69,8.89 180 top
USER_LED6  52.96,8.89 180 top
X1  12.83,29.84 270 top

### Tracks (layer width: path | path; a pad name or v marks a point on that pad's centre or on a via)
5V  (via drill 0.89)
  Top 0.203: R15.2 12.46,14.59 12.32,14.73 11.94,14.73 11.3,15.37 11.3,16.64 11.24,16.7 | U$2.17 53.13,22.38 C9.1 C8.1
  Top 0.508: 9.52,18.6 IC1.1 10.99,18.6 11.43,18.16 11.43,16.89 11.24,16.7 IC1.3 | 8.05,18.6 C13.1 | SV10.2 SV9.2 SV8.2 | SV8.2 70.1,19.43 70.23,19.56 70.23,18.41 SV8.2 | SV8.2 SV7.2 SV6.2 SV5.2 SV4.2 SV3.2 | SV3.2 70.1,36.96 70.36,37.21 70.36,36.96 SV3.2 | SV3.2 SV2.2 SV1.2
  Top 0.762: C9.1 52.96,17.14 59.18,10.92 v60.71,10.92 | X1.1 11.05,37.47 9.91,36.32 9.91,28.83 | 9.91,28.83 9.91,20.07 | 9.91,20.07 9.91,18.83 IC1.1 8.05,18.6 | X1.4 10.92,29.84 9.91,28.83 | C12.1 9.91,20.07 | C13.1 5.48,18.56 5.08,18.16 J4.2
  Bottom 0.508: SV1.2 70.1,45.34 69.6,45.85 68.39,45.85 67.56,46.29
  Bottom 0.762: 67.56,46.29 64.83,46.29 | 64.83,46.29 62.61,48.51 62.1,48.51 | 62.1,48.51 29.08,48.51 | 29.08,48.51 17.02,48.51 12.57,44.07 12.57,40.13 | 12.57,40.13 12.57,37.72 X1.1 | 64.83,46.29 65.02,46.1 SV1.4 SV2.4 SV3.4 SV4.4 SV5.4 SV6.4 SV7.4 | SV9.4 SV10.4 v60.71,10.92 | SV9.4 SV8.4 SV7.4 | SV7.4 SV9.4 | C102.1 12.57,40.13 | C103.1 62.09,48.53 62.1,48.51 | C104.1 29.1,48.53 29.08,48.51
!SS
  Top 0.203: U1.18 26.04,35.56 26.42,35.94 32.64,35.94 34.42,34.16 34.42,11.94 27.94,5.46 27.94,3.17 U$3.P9.17
+3V3  (via drill 0.38, 0.53, 0.61)
  Top 0.203: U1.25 21.19,27.81 C5.1 | R16.2 14.99,12.32 17.53,14.86 17.53,17.91 17.4,18.03 | C11.1 C10.1 U2.25 | U2.10 41.5,10.26 v41.27,10.03 | U1.10 28.85,27.18 C6.1 30.21,26.05 v30.23,26.04 | v26.04,11.56 26.04,13.57 C16.1 | 48.91,32.02 v48.9,32 | C3.1 48.77,32.13 v48.9,32 | U$1.17 49.25,32.36 v48.9,32
  Top 0.406: C10.1 41.92,19.92 v40.64,21.21
  Top 0.508: J3.2 26.92,19.94 | 26.92,19.94 J3.1 26.92,15.11 | 26.92,15.11 26.54,14.73 20.7,14.73 17.4,18.03 16.89,18.54 | R10.2 18.54,24.38 18.29,24.13 v18.29,24 18.29,19.94 16.89,18.54 | C5.1 20.46,28.05 20.19,28.32 18.41,28.32 v18.29,28.19 | 30.95,23.96 v30.8,23.81 26.92,19.94 | IC1.5 14.56,18.6 C14.1 C15.1 16.88,18.56 16.89,18.54 | C16.1 26.67,13.59 26.92,13.84 26.92,15.11 | v36.96,11.81 36.58,12.19 36.58,22.48 v37.34,23.24
  Bottom 0.203: 41.27,11.54 C100.1 41.42,10.18 v41.27,10.03 | v30.23,26.04 30.23,24.38 v30.8,23.81 | R100.1 R101.1 26.02,11.54 v26.04,11.56
  Bottom 0.406: v40.64,21.21 40.26,21.21 39.88,20.83
  Bottom 0.508: v18.29,28.19 v18.29,24 | v41.27,10.03 38.73,10.03 v36.96,11.81 | v30.8,23.81 31.37,23.24 v37.34,23.24 37.47,23.24 39.88,20.83 40.77,19.94 44.83,19.94 48.9,24 v48.9,32 49.01,31.89 C101.1
CH1
  Top 0.203: 59.05,18.8 U$2.27 59.08,16.87 61.6,14.35 61.6,11.68 64.39,8.89 67.06,8.89 67.56,9.4 SV10.3
CH2
  Top 0.203: U$2.28 59.82,18.75 59.82,17.14 64.26,12.76 66.42,12.76 67.56,13.84 SV9.3
CH3
  Top 0.203: 60.76,19.68 U$2.1 60.58,19.66 60.58,17.02 61.21,16.45 66.42,16.45 67.56,17.53 SV8.3
CH4
  Top 0.203: SV7.3 67.56,21.34 66.29,20.13 62.23,20.13 61.85,20.45 60.71,20.45 U$2.2
CH5
  Top 0.203: SV6.3 67.56,25.02 66.42,23.81 64.26,23.81 62.17,21.72 U$2.4
CH6
  Top 0.203: SV5.3 67.56,28.7 66.29,27.5 59.94,27.5 58.42,25.97 58.42,24.64 U$2.10
CH7
  Top 0.203: SV4.3 65.66,31.18 64.13,31.18 63.75,30.8 63.75,28.83 62.99,28.07 59.69,28.07 57.91,26.29 57.91,24.74 U$2.11
CH8
  Top 0.203: SV3.3 65.72,34.86 64.32,34.86 63.25,33.78 63.25,29.21 62.61,28.57 59.31,28.57 57.13,26.39 U$2.12
CH9
  Top 0.203: SV2.3 67.56,39.62 66.36,38.54 64.32,38.54 63.75,37.85 63.75,34.92 62.74,33.91 62.74,30.23 61.6,29.08 59.18,29.08 56.49,26.39 U$2.13
CH10
  Top 0.203: SV1.3 67.56,43.43 66.29,42.23 64.01,42.23 63.25,41.4 63.25,35.31 62.23,34.29 62.23,30.61 61.21,29.59 59.05,29.59 55.83,26.36 U$2.14
GND  (via drill 0.38, 0.64)
  Top 0.203: U1.24 24.74,28.47 | 24.74,28.47 24.77,28.45 | v24.77,26.54 U1.29 | v24.64,29.21 24.64,28.57 24.74,28.47 | U1.16 27.33,29.31 v27.43,29.21 | U1.5 26.7,26.31 26.8,26.42 v27.43,26.42 | C5.2 19.95,29.35 v19.94,29.34 | C7.2 19.3,23.1 19.3,21.08 19.94,20.45 J3.10 J3.9 | R5.2 v24.51,35.05 | C2.2 v26.92,35.05 | 3.3V.C 5V.C | USER_LED2.C USER_LED1.C 3.57,44.21 v3.56,44.83 | U2.5 40.87,13.82 40.89,13.84 v40.89,13.08 | U2.29 v43.43,15.75 42.8,15.75 42.82,15.77 U2.24 | U2.16 43.54,13.18 v43.43,13.08 | C17.2 v49.02,13.46 | R13.2 v49.02,16 | C10.2 C11.2 v43.43,22.73 45.41,24.71 USER_LED4.C 45.48,25.65 USER_LED3.C | v31.5,29.59 31.51,29.58 R7.2 C6.2 | 48.51,34.29 U$1.16 48.62,35.59 v48.51,35.69 | U$1.5 49.25,38.46 49.15,38.35 48.64,38.35 v48.51,38.48 | U$1.29 v48.51,35.69 | USER_LED6.C USER_LED5.C 51.68,8.13 v50.42,8.13 | U$2.5 58.45,22.38 U$2.29 56.49,23.01 | 56.49,23.01 U$2.16 54.86,22.99 53.98,22.99 53.32,23.64 C9.2 53.07,23.62 v50.67,23.62 50.69,23.64 C8.2 | C3.2 46.72,33.03 v46.35,33.4 46.74,33.02 48.39,33.02 48.51,33.15 v48.51,35.69 | 56.49,23.01 v56.39,23.11 | RESET.A 23.59,13.11 v23.49,13.21 | RESET.A' 16.64,11.12 v16.64,9.78
  Top 0.508: IC1.2 8.4,17.65 C13.2 | C15.2 C14.2 v14.61,16.13 | C16.2 23.88,13.59 v23.49,13.21
  Top 0.762: C12.2 12.33,21.73 X1.7 | C13.2 8,13.72 | 8,13.72 8,13.46 7.49,12.95 5.21,12.95 J4.1 | 5V.C 8,13.72
  other vias: 21.84,20.45 40.77,15.75 51.31,35.56 51.31,38.61 56.39,20.32 59.18,20.32 59.18,23.11
  pour Bottom: -13.72,57.78 77.09,57.78 77.09,-6.35 -13.72,-6.35
ICSPCLK  (via drill 0.38)
  Top 0.203: U1.2 24.74,23.27 25.65,22.35 J3.4 J3.3 v25.65,15.62 | v37.59,16.51 37.85,16.51 38.61,15.75 39.34,15.75 U2.2 | U$1.24 55.65,36.42 v58.42,33.66 | U$2.24 57.13,18.26 56.64,17.78 56.26,17.78 v56.13,17.65 56.13,15.88 v56.01,15.75
  Bottom 0.203: v25.65,15.62 29.08,15.62 30.35,16.89 37.21,16.89 v37.59,16.51 37.85,16.51 38.35,17.02 41.4,17.02 41.78,17.4 49.66,17.4 51.31,15.75 v56.01,15.75 | v58.42,33.66 58.42,33.53 62.23,29.72 62.23,25.4 61.6,24.77 55.88,24.77 54.74,23.62 54.74,19.05 v56.13,17.65 56.26,17.78
ICSPDAT  (via drill 0.38)
  Top 0.203: U1.1 24.08,22.53 24.38,22.23 J3.6 J3.5 v24.38,16.51 | 39.32,16.38 U2.1 38.28,17.53 v37.72,17.53 | U$1.25 56.77,37.08 v59.31,34.54 | U$2.25 57.79,17.14 v57.4,16.76
  Bottom 0.203: v24.38,16.51 28.83,16.51 30.23,17.91 37.34,17.91 v37.72,17.53 41.02,17.53 41.4,17.91 50.93,17.91 52.07,16.76 v57.4,16.76 57.4,17.65 55.24,19.81 55.24,23.37 56.13,24.26 61.85,24.26 62.74,25.15 62.74,31.11 v59.31,34.54
MCLR/VPP_A  (via drill 0.38)
  Top 0.203: v44.07,25.53 42.04,27.56 SV11.3 | U$2.26 58.45,15.65 v57.28,14.48 | v53.98,14.48 53.98,14.86 46.35,22.48 v46.35,24.51
  Bottom 0.203: v46.35,24.51 45.34,25.53 v44.07,25.53 | v57.28,14.48 v53.98,14.48
MCLR/VPP_P
  Top 0.203: SV11.1 39.62,20.83 41.53,18.92 41.53,17.3 U2.26
MCLR/VPP_U  (via drill 0.38)
  Top 0.203: U$1.26 55.02,37.74 v55.37,38.1 | v55.12,34.92 55.12,31.62 51.69,28.19 41.53,28.19 SV11.5
  Bottom 0.203: v55.37,38.1 55.37,35.18 v55.12,34.92
MCLR_LIDAR  (via drill 0.38)
  Top 0.203: J3.7 J3.8 23.11,22.35 22.35,23.11 C7.1 R10.1 | RESET.B' RESET.B 20.16,7.27 20.07,7.37 20.07,12.19 v21.72,13.84
  Bottom 0.203: R11.2 J3.7 21.72,16 v21.72,13.84
  other vias: 23.11,17.4
MISO
  Top 0.203: U1.21 24.08,31.04 23.62,31.5 23.62,36.32 24.26,36.96 33.4,36.96 35.43,34.92 35.43,7.75 33.02,5.33 33.02,3.17 U$3.P9.21
MOSI
  Top 0.203: U1.19 25.38,35.66 26.16,36.45 32.89,36.45 34.92,34.42 34.92,10.16 U$3.P9.18
N$1
  Top 0.203: R16.1 3.3V.A
N$2
  Top 0.203: USER_LED1.A R1.1
N$3
  Top 0.203: USER_LED2.A R2.1
N$4
  Top 0.203: R15.1 5V.A
N$5
  Top 0.203: USER_LED5.A R17.1
N$6
  Top 0.203: USER_LED6.A R18.1
N$9
  Top 0.203: USER_LED3.A R8.1
N$10
  Top 0.203: USER_LED4.A 48.56,25.59 R9.1
N$11  (via drill 0.38)
  Top 0.203: v33.53,24.13 v33.53,22.1 | SV11.2 SV11.4 SV11.6 SV11.8
  Bottom 0.203: SV11.2 36.2,24.13 v33.53,24.13 | v33.53,22.1 28.83,17.4 R11.1
P8.11  (via drill 0.38)
  Top 0.203: U2.23 43.46,18.31 44.45,19.3 v44.45,22.1 | v37.97,35.56 37.97,47.5 37.21,48.26 22.1,48.26 21.59,48.77 U$3.P8.11
  Bottom 0.203: v44.45,22.1 44.45,22.86 42.67,24.64 42.67,31.24 39.37,34.54 38.99,34.54 v37.97,35.56
P8.12  (via drill 0.38)
  Top 0.203: U2.22 44.12,17.45 45.47,18.8 v45.47,22.61 | v38.99,35.69 38.99,47.5 37.72,48.77 23.24,48.77 22.86,49.15 22.86,51.44 U$3.P8.12
  Bottom 0.203: v45.47,22.61 43.18,24.89 43.18,31.5 v38.99,35.69
P8.27
  Top 0.203: U$1.23 53.75,35.79 53.85,35.69 53.85,31.11 51.44,28.7 45.34,28.7 39.75,34.29 39.75,48.01 U$3.P8.27
P8.28
  Top 0.203: U$1.22 52.81,31.09 50.93,29.21 45.47,29.21 40.26,34.42 40.26,44.96 43.18,47.88 43.18,51.44 U$3.P8.28
P8.29
  Top 0.203: U$1.21 51.87,31.17 50.42,29.72 45.59,29.72 40.77,34.54 40.77,44.58 44.58,48.39 44.58,50.04 U$3.P8.29
P8.30
  Top 0.203: U$1.20 51.21,31.52 49.91,30.23 45.85,30.23 41.27,34.8 41.27,44.2 45.72,48.64 45.72,51.44 U$3.P8.30
P8.31
  Top 0.203: U$1.19 50.57,31.77 49.53,30.73 46.1,30.73 41.78,35.05 41.78,35.18 41.78,35.56 41.78,43.81 46.99,49.02 U$3.P8.31
P8.32
  Top 0.203: U$1.18 49.91,31.88 49.28,31.24 46.35,31.24 42.29,35.31 42.29,43.56 48.26,49.53 48.26,51.44 U$3.P8.32
P8.33
  Top 0.203: U$1.15 44.17,34.19 42.8,35.56 42.8,43.18 49.53,49.91 U$3.P8.33
P8.34
  Top 0.203: U$1.14 44.12,35.13 43.31,35.94 43.31,42.93 49.02,48.64 50.29,48.64 50.8,49.15 50.8,51.44 U$3.P8.34
P8.35
  Top 0.203: U$3.P8.35 52.07,48.9 51.31,48.13 49.4,48.13 43.81,42.55 43.81,36.32 44.32,35.81 46.99,35.81 U$1.13
P8.36
  Top 0.203: U$3.P8.36 53.34,51.44 53.34,48.39 52.58,47.62 49.66,47.62 45.59,43.56 45.59,38.1 45.97,37.72 46.99,37.72 U$1.10
P8.37
  Top 0.203: U$3.P8.37 54.61,47.88 53.85,47.12 50.04,47.12 46.1,43.18 46.1,38.73 46.48,38.35 46.99,38.35 U$1.9
P8.38
  Top 0.203: U$3.P8.38 55.88,51.44 55.88,47.12 55.37,46.61 50.55,46.61 46.99,43.05 46.99,39.06 U$1.8
P8.39
  Top 0.203: U$3.P8.39 57.15,46.86 56.39,46.1 51.44,46.1 47.88,42.55 47.88,40.06 U$1.7
P8.40
  Top 0.203: U$3.P8.40 57.15,52.32 58.42,51.05 58.42,46.74 57.28,45.59 52.32,45.59 48.64,41.91 48.64,40.01 U$1.6
P8.41
  Top 0.203: U$1.4 49.91,41.02 53.98,45.09 58.67,45.09 59.69,46.1 U$3.P8.41
P8.42
  Top 0.203: U$1.3 50.57,40.79 54.36,44.58 59.69,44.58 60.96,45.85 60.96,51.44 U$3.P8.42
P8.43
  Top 0.203: U$1.2 51.21,40.66 54.61,44.07 61.21,44.07 62.1,44.96 62.1,50.04 U$3.P8.43
P8.44
  Top 0.203: U$1.1 51.87,40.06 55.37,43.56 61.6,43.56 62.61,44.58 62.61,48.51 63.5,49.4 63.5,51.44 U$3.P8.44
P8.45
  Top 0.203: U$1.28 52.81,40.23 55.63,43.05 62.1,43.05 63.12,44.07 63.12,47.12 64.77,48.77 U$3.P8.45
P8.46
  Top 0.203: U$3.P8.46 66.17,51.31 66.17,49.02 63.63,46.48 63.63,43.81 62.36,42.55 56.01,42.55 53.59,40.13 53.59,38.48 53.49,38.38 U$1.27
P9.25
  Top 0.203: U2.8 38.1,9.58 38.1,3.17 U$3.P9.25
P9.27
  Top 0.203: U2.13 43.46,8.28 40.64,5.46 40.64,3.17 U$3.P9.27
P9.28
  Top 0.203: U2.14 44.12,8.05 41.91,5.84 U$3.P9.28
P9.29
  Top 0.203: U2.15 44.96,6.86 43.18,5.08 43.18,3.17 U$3.P9.29
P9.30
  Top 0.203: U2.18 49.28,14.48 50.04,13.72 50.04,10.92 44.32,5.21 44.32,4.57 U$3.P9.30
P9.31
  Top 0.203: U2.19 49.25,15.14 50.55,13.84 50.55,10.16 45.72,5.33 45.72,3.17 U$3.P9.31
RPLIDAR_EN
  Top 0.203: U1.23 22.33,29.11 21.97,29.46 21.97,33.27 20.19,35.05 12.95,35.05 X1.2
SCL  (via drill 0.38)
  Top 0.203: U2.4 37.97,14.48 v37.72,14.22 | v30.35,9.53 30.35,11.18 v33.4,14.22 33.78,14.61 33.78,17.78 v30.86,20.7 | U1.4 26.04,24.13 26.42,23.75 v27.81,23.75 29.21,23.75 30.73,25.27 31.88,25.27 33.4,26.8 33.4,32.38 32.26,33.53 v32.26,33.78 | U$1.11 45.34,37.08 v44.7,37.72 | U$2.8 60.43,24.61 v61.47,25.65
  Bottom 0.203: v37.72,14.22 v33.4,14.22 | U$3.P9.19 33.02,3.17 33.02,6.86 v30.35,9.53 29.72,10.16 R101.2 | v27.81,23.75 v30.86,20.7 | v32.26,33.78 36.2,37.72 v44.7,37.72 48.77,33.66 57.02,33.66 61.47,29.21 v61.47,25.65
SCLK
  Top 0.203: U1.22 23.24,30.99 22.99,31.24 22.99,36.45 24,37.47 33.78,37.47 35.94,35.31 35.94,6.1 U$3.P9.22
SDA  (via drill 0.38)
  Top 0.203: U2.3 37.95,15.14 v37.59,15.49 | v28.96,8.76 28.96,13.08 31.37,15.49 v32.89,15.49 32.89,16.38 v28.96,20.32 28.96,20.57 33.91,25.53 33.91,33.27 v33.4,33.78 | U1.3 25.38,23.9 v26.8,22.48 | U$1.12 44.86,36.42 v44.7,36.58 | U$2.9 59.08,25.43 v59.94,26.29
  Bottom 0.203: v37.59,15.49 v32.89,15.49 | U$3.P9.20 31.75,5.97 v28.96,8.76 R100.2 | v26.8,22.48 v28.96,20.32 | v33.4,33.78 36.2,36.58 v44.7,36.58 48.39,32.89 55.88,32.89 59.94,28.83 v59.94,26.29
UART_RX
  Top 0.203: U1.27 13.61,26.52 X1.5
UART_TX
  Top 0.203: U1.28 13.92,25.86 X1.6
USER1  (via drill 0.38)
  Top 0.203: U1.14 28.83,34.16 v29.46,34.8 | R1.2 25.53,42.93 v29.46,38.99
  Bottom 0.203: v29.46,34.8 v29.46,38.99
USER2  (via drill 0.38)
  Top 0.203: U1.15 27.99,34.59 v28.32,34.92 | R2.2 25.78,41.53 v28.32,38.99
  Bottom 0.203: v28.32,34.92 v28.32,38.99
USER3  (via drill 0.38)
  Top 0.203: U2.28 39.06,18.41 v38.99,18.41 | v46.48,20.19 46.61,20.32 47.62,20.32 52.96,14.99 R18.2
  Bottom 0.203: v38.99,18.41 39.75,19.18 45.47,19.18 v46.48,20.19
USER4  (via drill 0.38)
  Top 0.203: U2.27 40.87,18.19 v40.64,18.41 | v46.61,19.18 47.5,19.18 51.69,14.99 R17.2
  Bottom 0.203: v40.64,18.41 45.85,18.41 v46.61,19.18
USER5
  Top 0.203: U$2.15 54.89,26.77 54.36,27.3 R8.2
USER6  (via drill 0.38)
  Top 0.203: U$2.18 53.98,21.72 v53.98,21.59 | v53.98,24.38 53.98,25.02 53.09,25.91 50.18,25.91 R9.2
  Bottom 0.203: v53.98,21.59 v53.98,24.38
VBUS
  Top 0.203: U1.12 28.85,28.45 R7.1
VBUS_P  (via drill 0.38)
  Top 0.203: v42.8,10.54 42.8,11.66 U2.12
  Bottom 0.203: R102.1 42.78,10.68 v42.8,10.54
VDDCORE
  Top 0.203: U1.17 26.7,32.65 C2.1
VDDCORE_P
  Top 0.203: U2.17 46.37,13.82 C17.1
VPP/MCLR  (via drill 0.38)
  Top 0.203: U1.26 19.96,27.15 v19.81,27.3 | v18.92,35.94 21.72,35.94 23.75,37.97 34.29,37.97 SV11.7
  Bottom 0.203: v19.81,27.3 19.81,28.19 18.92,29.08 v18.92,35.94
VUSB
  Top 0.203: U1.20 24.74,32.52 R5.1
VUSB_P
  Top 0.203: 46.82,15.77 R13.1 46.49,15.77 U2.20

### Text on the board
tPlace: Joshua Stevens | Lidar | US | ADC | Piolt | EN | CH | 5V | GND